# Altium schematic sheet molly.SchDoc
size A4
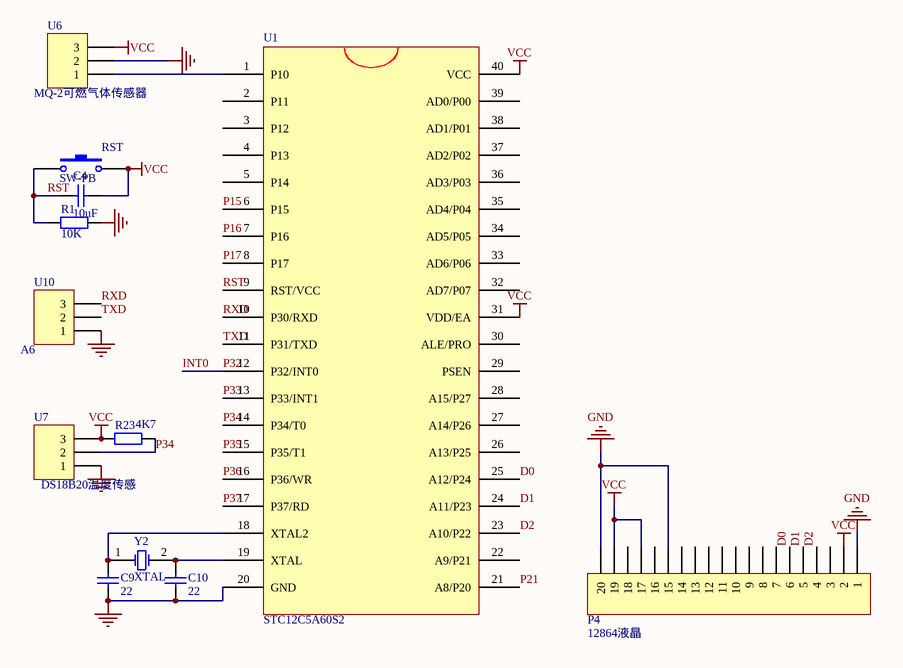
[diagram p0: molly.SchDoc]

## Parts
C4  value 10uF  [CAPR2.54-5.1x3.2]
C9  value 22  [2012[0805]]
C10  value 22  [2012[0805]]
P4  12864液晶  [HDR1X20]
R1  value 10K  [AXIAL-0.4]
R23  value 4K7  [AXIAL-0.4]
RST  SW-PB  [KEY_1]
U1  STC12C5A60S2  [DIP-40]
U6  MQ-2可燃气体传感器  [HDR1X3]
U7  DS18B20温度传感  [HDR1X3]
U10  A6  [HDR1X3]
Y2  XTAL  [SPST-2]

## Nets
GND: C9.2 C10.2 P4.1 P4.15 P4.20 R1.2 U1.20(GND) U6.2 U7.1 U10.1
VCC: C4.2 P4.2 P4.17 P4.19 R23.2 RST.2 U1.31(VDD/EA) U1.40(VCC) U6.3 U7.3
D0: P4.6 U1.25(A12/P24)
D1: P4.5 U1.24(A11/P23)
D2: P4.4 U1.23(A10/P22)
INT0: U1.12(P32/INT0)  [also labelled P32]
P15: U1.6(P15)
P16: U1.7(P16)
P17: U1.8(P17)
P21: U1.21(A8/P20)
P33: U1.13(P33/INT1)
P34: R23.1 U1.14(P34/T0) U7.2
P35: U1.15(P35/T1)
P36: U1.16(P36/WR)
P37: U1.17(P37/RD)
RST: C4.1 R1.1 RST.1 U1.9(RST/VCC)
RXD: U1.10(P30/RXD) U10.3
TXD: U1.11(P31/TXD) U10.2
NetC9_1: C9.1 U1.18(XTAL2) Y2.1(OSC1)
NetC10_1: C10.1 U1.19(XTAL) Y2.2(OSC2)
NetU1_1: U1.1(P10) U6.1

Not connected (* = marked no-connect by the designer): P4 3 7 8 9 10 11 12 13 14 16 18; U1 2(P11) 3(P12) 4(P13) 5(P14) 22(A9/P21) 26(A13/P25) 27(A14/P26) 28(A15/P27) 29(PSEN) 30(ALE/PRO) 32(AD7/P07) 33(AD6/P06) 34(AD5/P05) 35(AD4/P04) 36(AD3/P03) 37(AD2/P02) 38(AD1/P01) 39(AD0/P00)

## Library data of the parts
C4 = cap: Capacitor; Published: 8-Jun-2000; LatestRevisionDate: 17-Jul-2002; LatestRevisionNote: Re-released for DXP Platform.; Publisher: Altium Limited
C9 C10 = Cap: Capacitor; Published: 8-Jun-2000; LatestRevisionDate: 17-Jul-2002; LatestRevisionNote: Re-released for DXP Platform.; Publisher: Altium Limited
P4 = Header 20: Header, 20-Pin; LatestRevisionDate: 17-Jul-2002; LatestRevisionNote: Re-released for DXP Platform.; Publisher: Altium Limited
R1 R23 = Res2: Resistor; Published: 8-Jun-2000; LatestRevisionDate: 17-Jul-2002; LatestRevisionNote: Re-released for DXP Platform.; Publisher: Altium Limited
RST = SW-PB: Switch; Published: 24-Mar-1999; LatestRevisionDate: 17-Jul-2002; LatestRevisionNote: Re-released for DXP Platform.; Publisher: Altium Limited
U1 = at89s52
U6 U7 U10 = Header 3: Header, 3-Pin; LatestRevisionDate: 17-Jul-2002; LatestRevisionNote: Re-released for DXP Platform.; Publisher: Altium Limited
Y2 = XTAL: Crystal Oscillator; Published: 8-Jun-2000; LatestRevisionDate: 17-Jul-2002; LatestRevisionNote: Re-released for DXP Platform.; Publisher: Altium Limited